# Altium schematic sheet Input1.SchDoc
size A4
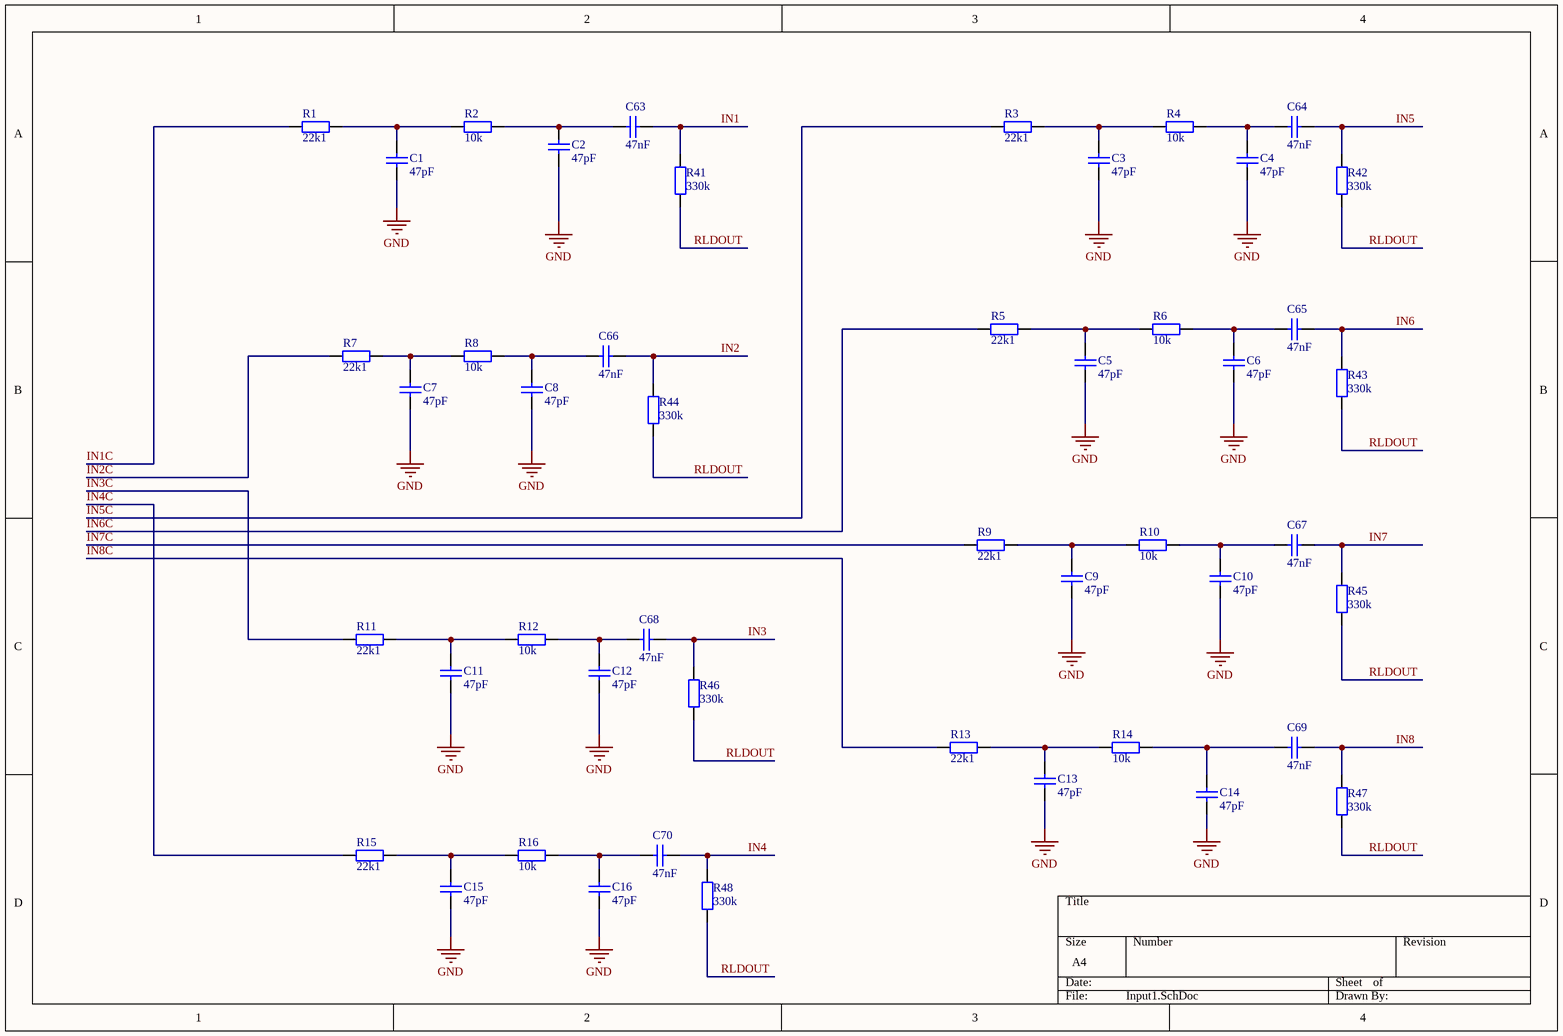
[diagram p0: Input1.SchDoc]

## Parts
C1  47pF  [C0603]
C2  47pF  [C0603]
C3  47pF  [C0603]
C4  47pF  [C0603]
C5  47pF  [C0603]
C6  47pF  [C0603]
C7  47pF  [C0603]
C8  47pF  [C0603]
C9  47pF  [C0603]
C10  47pF  [C0603]
C11  47pF  [C0603]
C12  47pF  [C0603]
C13  47pF  [C0603]
C14  47pF  [C0603]
C15  47pF  [C0603]
C16  47pF  [C0603]
C63  47nF  [C0603]
C64  47nF  [C0603]
C65  47nF  [C0603]
C66  47nF  [C0603]
C67  47nF  [C0603]
C68  47nF  [C0603]
C69  47nF  [C0603]
C70  47nF  [C0603]
R1  22k1  [RES0603]
R2  10k  [RES0603]
R3  22k1  [RES0603]
R4  10k  [RES0603]
R5  22k1  [RES0603]
R6  10k  [RES0603]
R7  22k1  [RES0603]
R8  10k  [RES0603]
R9  22k1  [RES0603]
R10  10k  [RES0603]
R11  22k1  [RES0603]
R12  10k  [RES0603]
R13  22k1  [RES0603]
R14  10k  [RES0603]
R15  22k1  [RES0603]
R16  10k  [RES0603]
R41  330k  [RES0603]
R42  330k  [RES0603]
R43  330k  [RES0603]
R44  330k  [RES0603]
R45  330k  [RES0603]
R46  330k  [RES0603]
R47  330k  [RES0603]
R48  330k  [RES0603]

## Nets
GND: C1.1 C2.1 C3.1 C4.1 C5.1 C6.1 C7.1 C8.1 C9.1 C10.1 C11.1 C12.1 C13.1 C14.1 C15.1 C16.1
IN1: C63.1 R41.2
IN1C: R1.1
IN2: C66.1 R44.2
IN2C: R7.1
IN3: C68.1 R46.2
IN3C: R11.1
IN4: C70.1 R48.2
IN4C: R15.1
IN5: C64.1 R42.2
IN5C: R3.1
IN6: C65.1 R43.2
IN6C: R5.1
IN7: C67.1 R45.2
IN7C: R9.1
IN8: C69.1 R47.2
IN8C: R13.1
RLDOUT: R41.1 R42.1 R43.1 R44.1 R45.1 R46.1 R47.1 R48.1
NetC1_2: C1.2 R1.2 R2.1
NetC2_2: C2.2 C63.2 R2.2
NetC3_2: C3.2 R3.2 R4.1
NetC4_2: C4.2 C64.2 R4.2
NetC5_2: C5.2 R5.2 R6.1
NetC6_2: C6.2 C65.2 R6.2
NetC7_2: C7.2 R7.2 R8.1
NetC8_2: C8.2 C66.2 R8.2
NetC9_2: C9.2 R9.2 R10.1
NetC10_2: C10.2 C67.2 R10.2
NetC11_2: C11.2 R11.2 R12.1
NetC12_2: C12.2 C68.2 R12.2
NetC13_2: C13.2 R13.2 R14.1
NetC14_2: C14.2 C69.2 R14.2
NetC15_2: C15.2 R15.2 R16.1
NetC16_2: C16.2 C70.2 R16.2

## Library data of the parts
C1-C16 C63-C70 = Cap: Capacitor; Value: 100pF; Published: 8-Jun-2000; LatestRevisionDate: 17-Jul-2002; LatestRevisionNote: Re-released for DXP Platform.; PackageReference: RAD-0.3; Publisher: Altium Limited; PackageDescription: Radial Cap, Thru-Hole; 2 Leads; 0.3 in Pin Spacing
R1-R16 R41-R48 = Res2: Resistor; Value: 1K; Published: 8-Jun-2000; LatestRevisionDate: 17-Jul-2002; LatestRevisionNote: Re-released for DXP Platform.; PackageReference: AXIAL-0.4; Publisher: Altium Limited; PackageDescription: Axial Device, Thru-Hole; 2 Leads; 0.4 in Pin Spacing